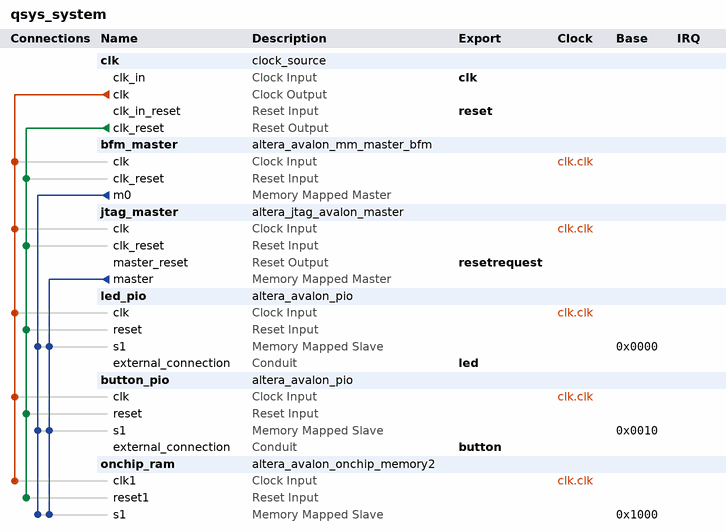
[diagram p0: system contents]
# Platform Designer (Qsys) system qsys_system
# Parameters at their usual value, and those the tool derives, are not listed.
package require -exact qsys 11.1
create_system qsys_system
set_project_property DEVICE_FAMILY CYCLONEIVE

add_instance clk clock_source 11.1
set_instance_parameter_value clk clockFrequency 50000000

add_instance bfm_master altera_avalon_mm_master_bfm 11.1
set_instance_parameter_value bfm_master AV_ADDRESS_W 32
set_instance_parameter_value bfm_master AV_NUMSYMBOLS 4
set_instance_parameter_value bfm_master AV_BURSTCOUNT_W 3
set_instance_parameter_value bfm_master AV_READRESPONSE_W 8
set_instance_parameter_value bfm_master AV_WRITERESPONSE_W 8
set_instance_parameter_value bfm_master USE_READ 1
set_instance_parameter_value bfm_master USE_BYTE_ENABLE 1
set_instance_parameter_value bfm_master USE_BURSTCOUNT 0
set_instance_parameter_value bfm_master USE_READ_DATA 1
set_instance_parameter_value bfm_master USE_READ_DATA_VALID 1
set_instance_parameter_value bfm_master USE_WAIT_REQUEST 1
set_instance_parameter_value bfm_master AV_CONSTANT_BURST_BEHAVIOR 1
set_instance_parameter_value bfm_master AV_BURST_LINEWRAP 1
set_instance_parameter_value bfm_master AV_BURST_BNDR_ONLY 1
set_instance_parameter_value bfm_master AV_FIX_READ_LATENCY 1
set_instance_parameter_value bfm_master AV_READ_WAIT_TIME 1
set_instance_parameter_value bfm_master ADDRESS_UNITS SYMBOLS

add_instance jtag_master altera_jtag_avalon_master 11.1

add_instance led_pio altera_avalon_pio 11.1
set_instance_parameter_value led_pio direction Output
set_instance_parameter_value led_pio width 8

add_instance button_pio altera_avalon_pio 11.1
set_instance_parameter_value button_pio direction Input
set_instance_parameter_value button_pio width 8

add_instance onchip_ram altera_avalon_onchip_memory2 11.1
set_instance_parameter_value onchip_ram dataWidth 32
set_instance_parameter_value onchip_ram dualPort false
set_instance_parameter_value onchip_ram initMemContent false
set_instance_parameter_value onchip_ram initializationFileName onchip_ram
set_instance_parameter_value onchip_ram memorySize 4096

# connections
add_connection clk.clk bfm_master.clk clock
add_connection clk.clk button_pio.clk clock
add_connection clk.clk jtag_master.clk clock
add_connection clk.clk led_pio.clk clock
add_connection clk.clk onchip_ram.clk1 clock
add_connection clk.clk_reset bfm_master.clk_reset reset
add_connection clk.clk_reset button_pio.reset reset
add_connection clk.clk_reset jtag_master.clk_reset reset
add_connection clk.clk_reset led_pio.reset reset
add_connection clk.clk_reset onchip_ram.reset1 reset
add_connection bfm_master.m0 button_pio.s1 avalon
set_connection_parameter_value bfm_master.m0/button_pio.s1 baseAddress 0x0010
add_connection bfm_master.m0 led_pio.s1 avalon
set_connection_parameter_value bfm_master.m0/led_pio.s1 baseAddress 0x0000
add_connection bfm_master.m0 onchip_ram.s1 avalon
set_connection_parameter_value bfm_master.m0/onchip_ram.s1 baseAddress 0x1000
add_connection jtag_master.master button_pio.s1 avalon
set_connection_parameter_value jtag_master.master/button_pio.s1 baseAddress 0x0010
add_connection jtag_master.master led_pio.s1 avalon
set_connection_parameter_value jtag_master.master/led_pio.s1 baseAddress 0x0000
add_connection jtag_master.master onchip_ram.s1 avalon
set_connection_parameter_value jtag_master.master/onchip_ram.s1 baseAddress 0x1000

# exported interfaces
add_interface clk clock sink
set_interface_property clk EXPORT_OF clk.clk_in
add_interface reset reset sink
set_interface_property reset EXPORT_OF clk.clk_in_reset
add_interface resetrequest reset source
set_interface_property resetrequest EXPORT_OF jtag_master.master_reset
add_interface led conduit end
set_interface_property led EXPORT_OF led_pio.external_connection
add_interface button conduit end
set_interface_property button EXPORT_OF button_pio.external_connection

save_system qsys_system.qsys
